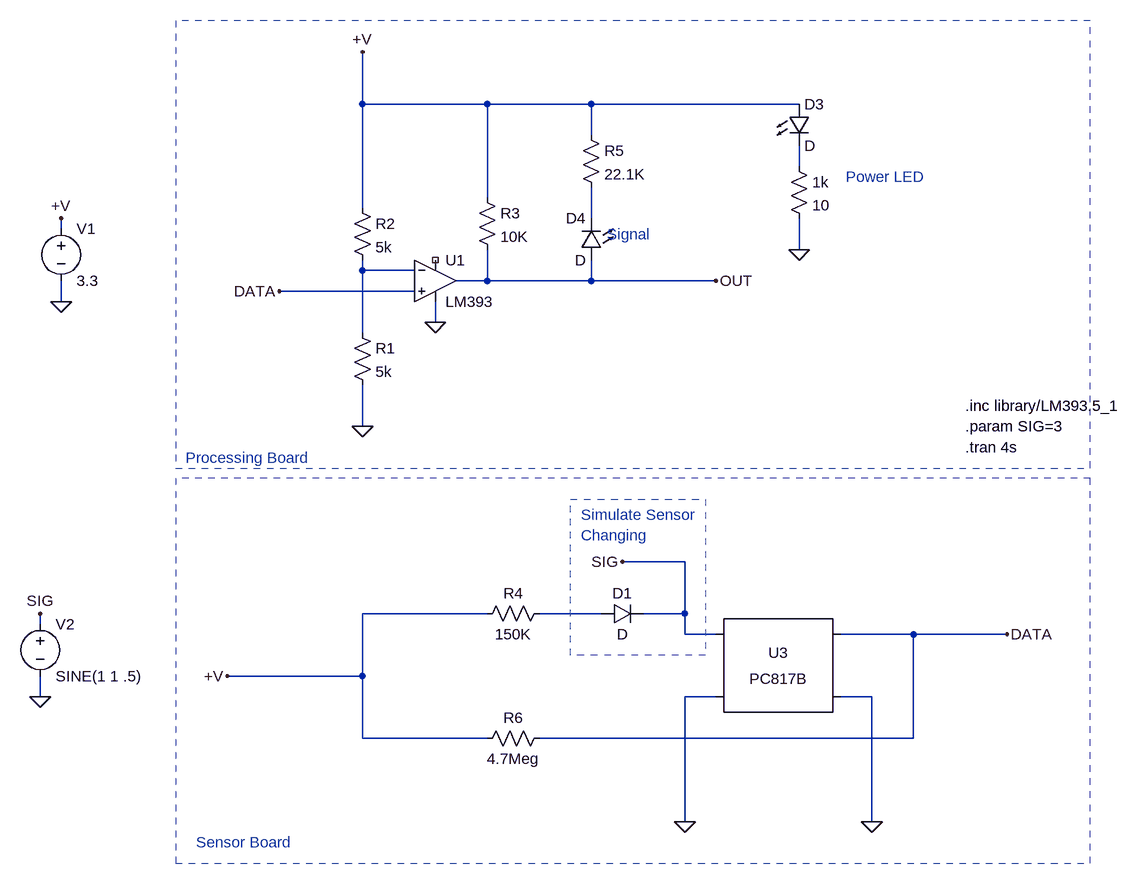
[diagram p0: schematic IR_board.asc]
IR_board.asc, the LTspice schematic file:
Version 4
SHEET 1 1216 1196
WIRE -208 -32 -208 -112
WIRE -16 -32 -208 -32
WIRE 144 -32 -16 -32
WIRE 464 -32 144 -32
WIRE 144 16 144 -32
WIRE 464 64 464 32
WIRE -16 112 -16 -32
WIRE -208 128 -208 -32
WIRE 144 144 144 96
WIRE -672 160 -672 144
WIRE 464 192 464 144
WIRE -208 224 -208 208
WIRE -128 224 -208 224
WIRE -16 240 -16 192
WIRE -16 240 -64 240
WIRE 144 240 144 208
WIRE 144 240 -16 240
WIRE 336 240 144 240
WIRE -128 256 -336 256
WIRE -672 272 -672 240
WIRE -96 304 -96 272
WIRE -208 320 -208 224
WIRE -208 464 -208 400
WIRE 288 672 192 672
WIRE -16 752 -208 752
WIRE 160 752 64 752
WIRE 288 752 288 672
WIRE 288 752 224 752
WIRE -704 768 -704 752
WIRE 288 784 288 752
WIRE 336 784 288 784
WIRE 640 784 528 784
WIRE 784 784 640 784
WIRE -208 848 -208 752
WIRE -208 848 -416 848
WIRE -704 880 -704 848
WIRE 336 880 288 880
WIRE 576 880 528 880
WIRE -208 944 -208 848
WIRE -16 944 -208 944
WIRE 640 944 640 784
WIRE 640 944 64 944
WIRE 288 1072 288 880
WIRE 576 1072 576 880
FLAG -672 272 0
FLAG -672 144 +V
FLAG -208 -112 +V
FLAG -96 304 0
FLAG -208 464 0
FLAG 336 240 OUT
FLAG -704 880 0
FLAG -704 752 SIG
FLAG 464 192 0
FLAG -416 848 +V
FLAG 784 784 DATA
FLAG -336 256 DATA
FLAG 192 672 SIG
FLAG 288 1072 0
FLAG 576 1072 0
SYMBOL voltage -672 144 R0
SYMATTR InstName V1
SYMATTR Value 3.3
SYMBOL res -224 304 R0
SYMATTR InstName R1
SYMATTR Value 5k
SYMATTR SpiceLine tol=1 pwr=0.1
SYMBOL res -224 112 R0
SYMATTR InstName R2
SYMATTR Value 5k
SYMATTR SpiceLine tol=1 pwr=0.1
SYMBOL Opamps\\opamp2 -96 176 R0
SYMATTR InstName U1
SYMATTR Value LM393
SYMBOL voltage -704 752 R0
WINDOW 123 0 0 Left 0
WINDOW 39 0 0 Left 0
SYMATTR InstName V2
SYMATTR Value SINE(1 1 .5)
SYMBOL res -32 96 R0
SYMATTR InstName R3
SYMATTR Value 10K
SYMATTR SpiceLine tol=1 pwr=0.1
SYMBOL res 448 48 R0
SYMATTR InstName 1k
SYMATTR Value 10
SYMATTR SpiceLine tol=1 pwr=0.1
SYMBOL res 128 0 R0
SYMATTR InstName R5
SYMATTR Value 22.1K
SYMATTR SpiceLine tol=1 pwr=0.1
SYMBOL res 80 736 R90
WINDOW 0 0 56 VBottom 2
WINDOW 3 32 56 VTop 2
SYMATTR InstName R4
SYMATTR Value 150K
SYMATTR SpiceLine tol=1 pwr=0.1
SYMBOL res 80 928 R90
WINDOW 0 0 56 VBottom 2
WINDOW 3 32 56 VTop 2
SYMATTR InstName R6
SYMATTR Value 4.7Meg
SYMATTR SpiceLine tol=1 pwr=0.1
SYMBOL LED 448 -32 R0
SYMATTR InstName D3
SYMBOL LED 160 208 R180
WINDOW 0 24 64 Left 2
WINDOW 3 24 0 Left 2
SYMATTR InstName D4
SYMBOL Optos\\PC817B 432 832 R0
SYMATTR InstName U3
SYMBOL diode 160 768 R270
WINDOW 0 32 32 VTop 2
WINDOW 3 0 32 VBottom 2
SYMATTR InstName D1
TEXT 720 432 Left 2 !.inc library/LM393.5_1
TEXT 720 464 Left 2 !.param SIG=3
TEXT 720 496 Left 2 !.tran 4s
TEXT 536 80 Left 2 ;Power LED
TEXT 168 168 Left 2 ;Signal
TEXT 128 600 Left 2 ;Simulate Sensor\nChanging
TEXT -464 1104 Left 2 ;Sensor Board
TEXT -480 512 Left 2 ;Processing Board
RECTANGLE Normal 320 816 112 576 2
RECTANGLE Normal -496 1136 912 544 2
RECTANGLE Normal 912 -160 -496 528 2

The netlist it stands for:
* IR_board.asc
V1 +V 0 3.3
R1 N003 0 5k tol=1 pwr=0.1
R2 +V N003 5k tol=1 pwr=0.1
XU1 DATA N003 NC_01 0 OUT LM393  ; pins In+ In- V+ V- OUT
V2 SIG 0 SINE(1 1 .5)
R3 +V OUT 10K tol=1 pwr=0.1
R§1k N001 0 10 tol=1 pwr=0.1
R5 +V N002 22.1K tol=1 pwr=0.1
R4 N004 +V 150K tol=1 pwr=0.1
R6 DATA +V 4.7Meg tol=1 pwr=0.1
D3 +V N001 D
D4 OUT N002 D
XU3 SIG 0 DATA 0 PC817 Igain=1.5m
D1 N004 SIG D
.model D D
.lib standard.dio
.inc library/LM393.5_1
.param SIG=3
.tran 4s
* Power LED
* Signal
* Simulate Sensor
* Changing
* Sensor Board
* Processing Board
.lib PC817.sub
.backanno
.end